# EAGLE design tama (EAGLE 6.5.0)
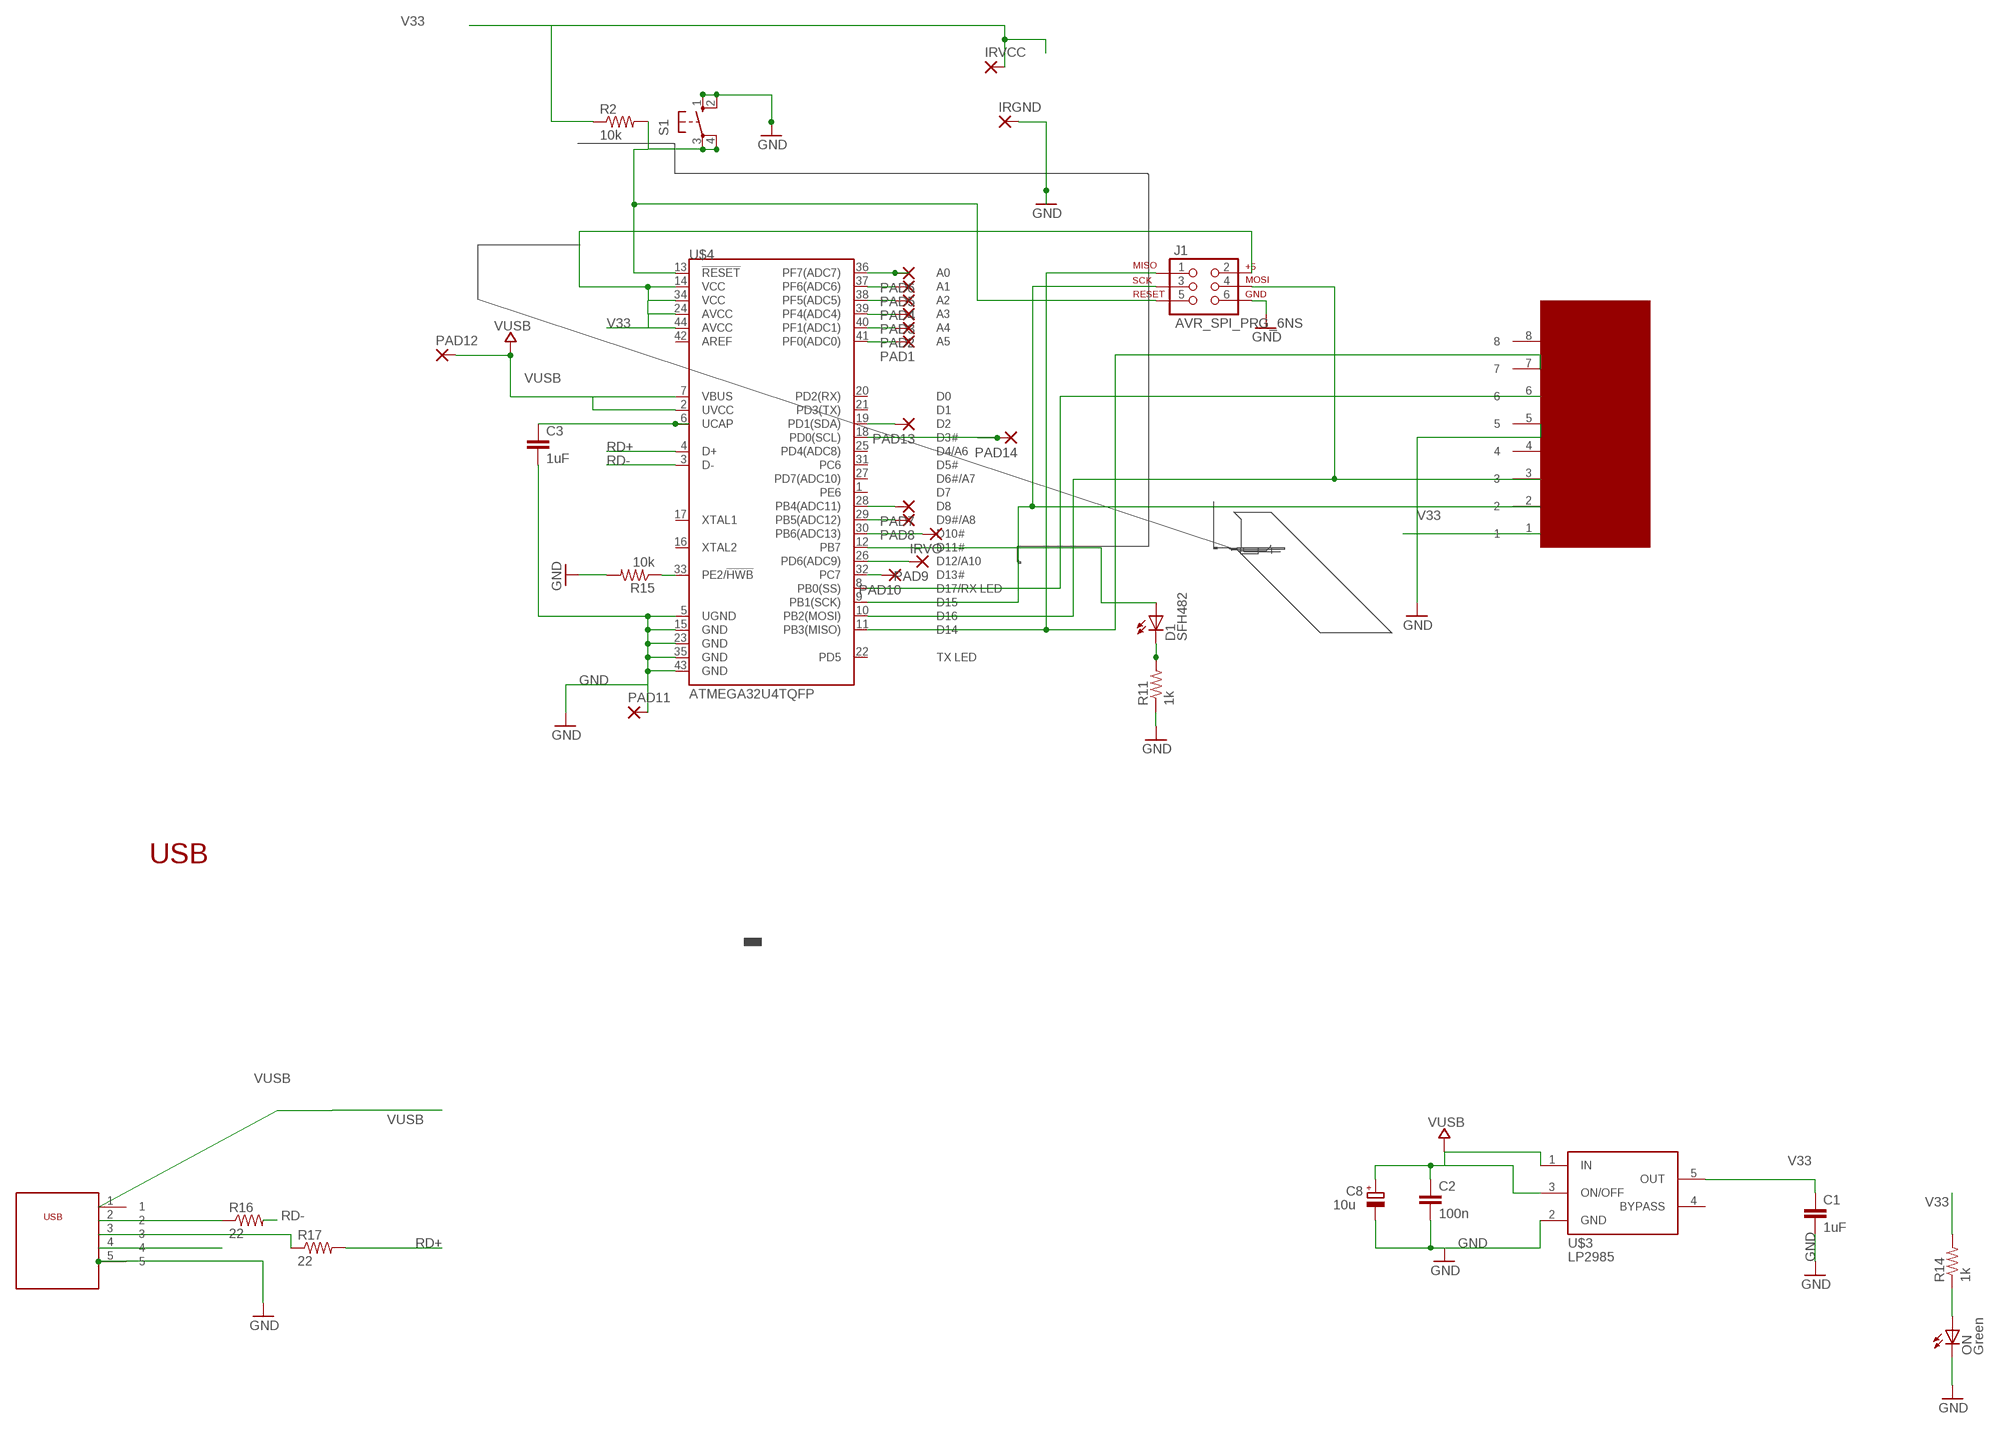
[diagram p0: schematic, sheet 1]

## Parts
C1  1uF  C-EUC1206  [C1206]
C2  100n  C-EUC1206  [C1206]
C3  1uF  C-EUC1206  [C1206]
C8  10u  CPOL-EUSMCB  [SMC_B]
D1  SFH482  [SFH482]
IRGND  2,15/1,0  [2,15/1,0]
IRVCC  2,15/1,0  [2,15/1,0]
IRVO  2,15/1,0  [2,15/1,0]
J1  AVR_SPI_PRG_6NS  [2X3-NS]
ON  Green  LEDCHIPLED_0805  [CHIPLED_0805]
PAD1  2,54/0,8  [2,54/0,8]
PAD2  2,54/0,8  [2,54/0,8]
PAD3  2,54/0,8  [2,54/0,8]
PAD4  2,54/0,8  [2,54/0,8]
PAD5  2,54/0,8  [2,54/0,8]
PAD6  2,54/0,8  [2,54/0,8]
PAD7  2,54/0,8  [2,54/0,8]
PAD8  2,54/0,8  [2,54/0,8]
PAD9  2,54/0,8  [2,54/0,8]
PAD10  2,54/0,8  [2,54/0,8]
PAD11  2,54/0,8  [2,54/0,8]
PAD12  2,54/0,8  [2,54/0,8]
PAD13  2,54/0,8  [2,54/0,8]
PAD14  2,54/0,8  [2,54/0,8]
R2  10k  R-US_R1206W  [R1206W]
R11  1k  R-US_R1206  [R1206]
R14  1k  R-US_R1206  [R1206]
R15  10k  R-US_R1206  [R1206]
R16  22  R-US_R1206  [R1206]
R17  22  R-US_R1206  [R1206]
S1  10-XX  [B3F-10XX]
U$1  TAMA  [TAMACONTACT]
U$2  USB  [USB]
U$3  LP2985  [SOT23-5]
U$4  ATMEGA32U4TQFP  [SPARKFUN-DIGITALIC_TQFP44]

## Nets
D-: R16.1 U$2.2
GND [gnd]: C1.2 C2.2 C3.2 C8.- IRGND.1(P) J1.6 ON.C PAD11.1(P) R11.1 R15.2 S1.1(S) S1.2(S1) U$1.5 U$2.5 U$3.2(GND) U$4.5(UGND) U$4.15(GND) U$4.23(GND) U$4.35(GND) U$4.43(GND)
IO11*: D1.A U$4.12(PB7)
N$1: PAD6.1(P) U$4.36(PF7(ADC7))
N$2: PAD5.1(P) U$4.37(PF6(ADC6))
N$3: ON.A R14.1
N$4: PAD4.1(P) U$4.38(PF5(ADC5))
N$5: PAD3.1(P) U$4.39(PF4(ADC4))
N$6: PAD13.1(P) U$4.19(PD1(SDA))
N$7: D1.K(C) R11.2
N$8: R17.1 U$2.3
N$9: PAD2.1(P) U$4.40(PF1(ADC1))
N$10 [usbvcc]: J1.5 R2.2 S1.3(P) S1.4(P1) U$4.13(!RESET)
N$12: PAD1.1(P) U$4.41(PF0(ADC0))
N$13: PAD14.1(P) U$4.18(PD0(SCL))
N$14: PAD9.1(P) U$4.26(PD6(ADC9))
N$15: R15.1 U$4.33(PE2/!HWB)
N$16: PAD10.1(P) U$4.32(PC7)
N$17: PAD7.1(P) U$4.28(PB4(ADC11))
N$18: PAD8.1(P) U$4.29(PB5(ADC12))
N$19: J1.1 U$1.7 U$4.11(PB3(MISO))
N$20: C3.1 U$4.6(UCAP)
N$22: J1.4 U$1.3 U$4.10(PB2(MOSI))
N$23: U$1.6 U$4.8(PB0(SS))
N$24: IRVO.1(P) U$4.30(PB6(ADC13))
RD+: R17.2 U$4.4(D+)
RD-: R16.2 U$4.3(D-)
SCK: J1.3 U$1.2 U$4.9(PB1(SCK))
USBID: U$2.4
V33: C1.1 IRVCC.1(P) J1.2 R2.1 R14.2 U$1.1 U$3.5(OUT) U$4.14(VCC) U$4.24(AVCC) U$4.34(VCC) U$4.44(AVCC)
VUSB: C2.1 C8.+ PAD12.1(P) U$2.1 U$3.1(IN) U$3.3(ON/OFF) U$4.2(UVCC) U$4.7(VBUS)
Unconnected: U$1.4 U$1.8 U$3.4(BYPASS) U$4.1(PE6) U$4.16(XTAL2) U$4.17(XTAL1) U$4.20(PD2(RX)) U$4.21(PD3(TX)) U$4.22(PD5) U$4.25(PD4(ADC8)) U$4.27(PD7(ADC10)) U$4.31(PC6) U$4.42(AREF)

## Notes on the sheet
- USB
- C:/Users/Natalie/Documents/egg.bmp

## Library data of the parts
C1-C3 = rcl:C-EU: CAPACITOR, European symbol
C8 = rcl:CPOL-EU: POLARIZED CAPACITOR, European symbol
D1 = led:SFH482: IR LED infrared emitting diode, Infineon
IRGND IRVCC IRVO = wirepad:2,15/1,0: THROUGH-HOLE PAD
J1 = SparkFun-Connectors:AVR_SPI_PRG_6: AVR ISP 6 Pin This is the reduced ISP connector for AVR programming. Common on Arduino. This footprint will take up less PCB space and can be used with a 10-pin to 6-pin adapter such as SKU: BOB-08508
ON = led:LED: LED OSRAM: - CHIPLED LG R971, LG N971, LY N971, LG Q971, LY Q971, LO R971, LY R971 LH N974, LH R974 LS Q976, LO Q976, LY Q976 LO Q996 - Hyper CHIPLED LW Q18S LB Q993, LB Q99A, LB R99A - SideLED LS A670, LO A670, LY A670, LG A670, LP A670 LB A673, LV A673, LT A673, LW A673 LH A674 LY A675 LS A676, LA A676, LO A676, LY A676, LW A676 LS A679, LY A679, LG A679 - Hyper Micro SIDELED® LS Y876, LA Y876, LO Y876, LY Y876 LT Y87S - SmartLED LW L88C, LW L88S LB L89C, LB L89S, LG L890 LS L89K, LO L89K, LY L89K LS L896, LA L896, LO L896, LY L896 - TOPLED LS T670, LO T670, LY T670, LG T670, LP T670 LSG T670, LSP T670, LSY T670, LOP T670, LYG T670 LG T671, LOG T671, LSG T671 LB T673, LV T673, LT T673, LW T673 LH T674 LS T676, LA T676, LO T676, LY T676, LB T676, LH T676, LSB T676, LW T676 LB T67C, LV T67C, LT T67C, LS T67K, LO T67K, LY T67K, LW E67C LS E67B, LA E67B, LO E67B, LY E67B, LB E67C, LV E67C, LT E67C LW T67C LS T679, LY T679, LG T679 LS T770, LO T770, LY T770, LG T770, LP T770 LB T773, LV T773, LT T773, LW T773 LH T774 LS E675, LA E675, LY E675, LS T675 LS T776, LA T776, LO T776, LY T776, LB T776 LHGB T686 LT T68C, LB T68C - Hyper Mini TOPLED® LB M676 - Mini TOPLED Santana® LG M470 LS M47K, LO M47K, LY M47K Source: http://www.osram.convergy.de LUXEON: - LUMILED® LXK2-PW12-R00, LXK2-PW12-S00, LXK2-PW14-U00, LXK2-PW14-V00 LXK2-PM12-R00, LXK2-PM12-S00, LXK2-PM14-U00 LXK2-PE12-Q00, LXK2-PE12-R00, LXK2-PE12-S00, LXK2-PE14-T00, LXK2-PE14-U00 LXK2-PB12-K00, LXK2-PB12-L00, LXK2-PB12-M00, LXK2-PB14-N00, LXK2-PB14-P00, LXK2-PB14-Q00 LXK2-PR12-L00, LXK2-PR12-M00, LXK2-PR14-Q00, LXK2-PR14-R00 LXK2-PD12-Q00, LXK2-PD12-R00, LXK2-PD12-S00 LXK2-PH12-R00, LXK2-PH12-S00 LXK2-PL12-P00, LXK2-PL12-Q00, LXK2-PL12-R00 Source: www.luxeon.com KINGBRIGHT: KA-3528ASYC Source: www.kingbright.com
PAD1-PAD14 = wirepad:2,54/0,8: THROUGH-HOLE PAD
R2 R11 R14-R17 = resistor:R-US_: RESISTOR, American symbol
S1 = switch-omron:10-XX: OMRON SWITCH; MPN: B3F-1000; OC_FARNELL: 176432; OC_NEWARK: 36M3542
U$1 = tama:TAMA
U$2 = usb:USB
U$3 = kris-verified:LP2985
U$4 = SparkFun-DigitalIC:ATMEGA32U4: Atmel 44-pin 8-bit Microcontroller with 32KBytes of ISP Flash and USB Controller ----- Please use the QFN-44-NOPAD_1:1 package for the footprint of all boards using a 32U4. Route traces directly away from the pads as much as possible.

## Net classes
0 default: width 0.254 mm, drill 0.61 mm, clearance 0.254 mm
1 power: width 0.254 mm, drill 0.61 mm, clearance 0.254 mm
2 gnd: width 0.254 mm, drill 0.61 mm, clearance 0.254 mm
3 usbvcc: width 0.254 mm, drill 0.61 mm, clearance 0.254 mm
4 aref: width 0.254 mm, drill 0.61 mm, clearance 0.254 mm

## Board
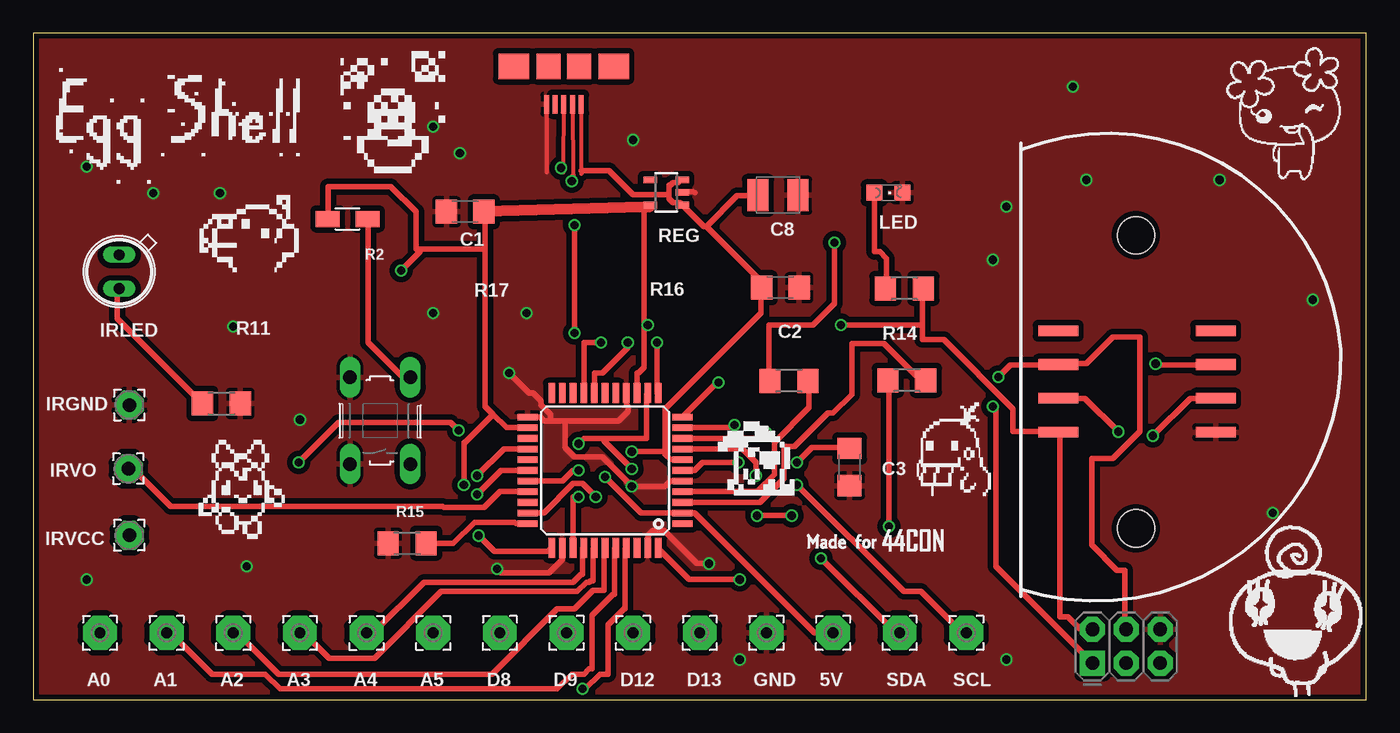
[diagram p1: board, top side]
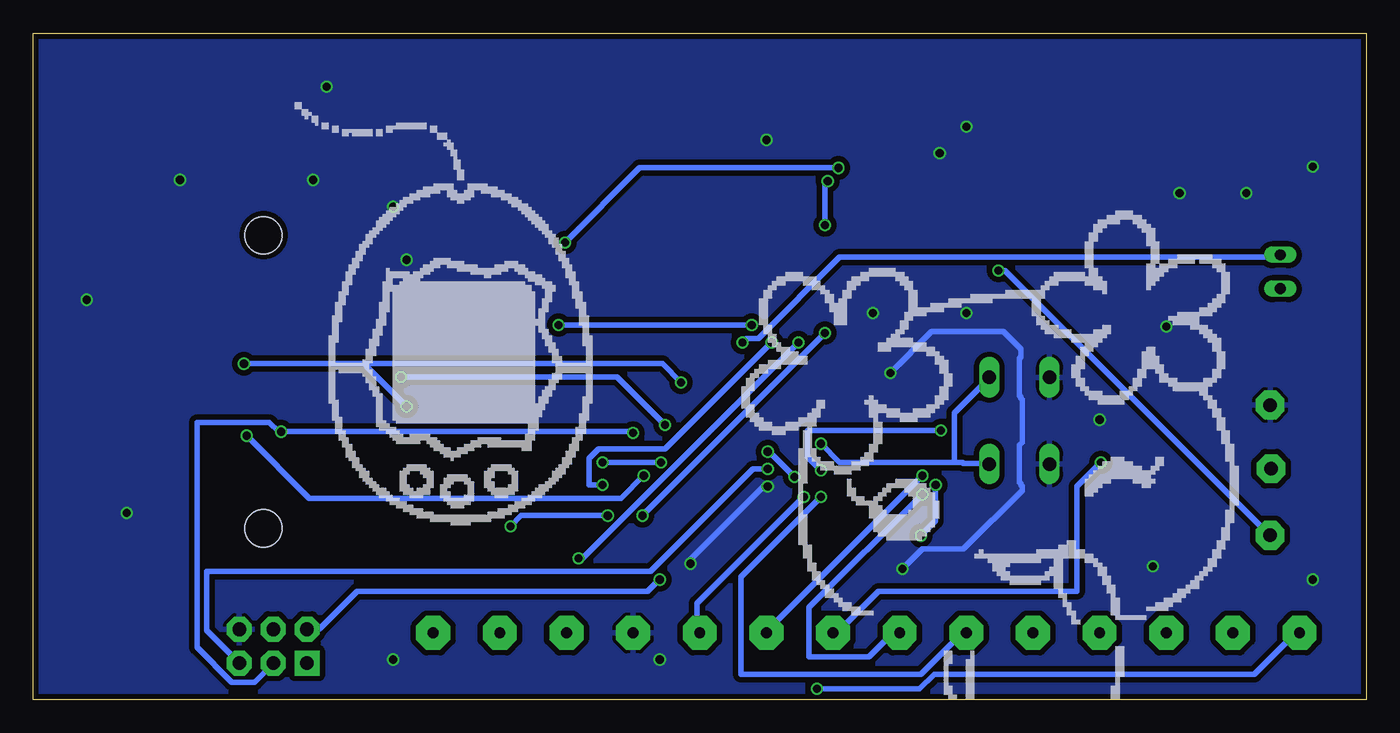
[diagram p2: board, bottom side, seen from below]

Size 100 x 50 mm. Coordinates in mm from the lower left corner, seen from the top.
Outline: 0,0 100,0 100,50 0,50 0,0
Copper layers (1*2*15*16): Top 0.035mm / dielectric 0.2mm / layer 2 0.0175mm / dielectric 1.1mm / layer 15 0.0175mm / dielectric 0.2mm / Bottom 0.035mm
Design rules "SeeedStudio_DRU_no_angle_20130527": minimum track width 6mil, minimum drill 12mil, track to track 6mil, track to pad 6mil, pad to pad 6mil, via to via 6mil, smd to smd 0mil, copper to edge 10mil, drill to drill 10mil, minimum pad ring 6mil, minimum via ring 6mil, stop-mask expansion 2mil, vias tented up to drill 25mil, thermal gap 10mil
Holes 2.8 mm at 82.73,34.84 82.73,12.85

### Footprints (pad centres in the part's own frame; a part is rotated, then mirrored left to right if it is on the bottom)
C1206 = smd 1.6 x 1.8: 1 -1.4,0; 2 1.4,0
SMC_B = smd 1.6 x 2.4: + -1.5,0; - 1.5,0
SFH482 = drill 0.813 long: A -1.27,0; K 1.27,0
2,15/1,0 = drill 1.016 pad 2.159 octagon: 1 0,0
2X3-NS = drill 1.016 pad 1.88 square: 1 -2.54,-1.27 | drill 1.016 pad 1.88 octagon: 2 -2.54,1.27; 3 0,-1.27; 4 0,1.27; 5 2.54,-1.27; 6 2.54,1.27
CHIPLED_0805 = smd 1.2 x 1.2: A 0,-1.05; C 0,1.05
2,54/0,8 = drill 0.813 pad 2.54 octagon: 1 0,0
R1206W = smd 1.8 x 1.2: 1 -1.499,0; 2 1.499,0
R1206 = smd 1.6 x 1.803: 1 -1.422,0; 2 1.422,0
B3F-10XX = drill 1.016 long: 1 -3.251,2.261; 2 3.251,2.261; 3 -3.251,-2.261; 4 3.251,-2.261
TAMACONTACT = smd 3 x 0.8: 1 0,1.81; 2 0,4.35; 3 0,6.89; 4 0,9.43; 5 11.8,1.81; 6 11.8,4.35; 7 11.8,6.89; 8 11.8,9.43
USB = smd 0.38 x 1.4: 1 -1.3,2.85; 2 -0.65,2.85; 3 0,2.85; 4 0.65,2.85; 5 1.3,2.85 | smd 1.8 x 1.9: P$1 -1.15,0; P$2 1.15,0 | smd 2.3 x 1.9: P$3 -3.75,0; P$5 3.75,0
SOT23-5 = smd 0.5 x 1: 1 -0.95,-1.2; 2 0,-1.2; 3 0.95,-1.2; 4 0.95,1.2; 5 -0.95,1.2
SPARKFUN-DIGITALIC_TQFP44 = smd 1.5 x 0.5: 1 -5.8,4; 2 -5.8,3.2; 3 -5.8,2.4; 4 -5.8,1.6; 5 -5.8,0.8; 6 -5.8,0; 7 -5.8,-0.8; 8 -5.8,-1.6; 9 -5.8,-2.4; 10 -5.8,-3.2; 11 -5.8,-4; 23 5.8,-4; 24 5.8,-3.2; 25 5.8,-2.4; 26 5.8,-1.6; 27 5.8,-0.8; 28 5.8,0; 29 5.8,0.8; 30 5.8,1.6; 31 5.8,2.4; 32 5.8,3.2; 33 5.8,4 | smd 0.5 x 1.5: 12 -4,-5.8; 13 -3.2,-5.8; 14 -2.4,-5.8; 15 -1.6,-5.8; 16 -0.8,-5.8; 17 0,-5.8; 18 0.8,-5.8; 19 1.6,-5.8; 20 2.4,-5.8; 21 3.2,-5.8; 22 4,-5.8; 34 4,5.8; 35 3.2,5.8; 36 2.4,5.8; 37 1.6,5.8; 38 0.8,5.8; 39 0,5.8; 40 -0.8,5.8; 41 -1.6,5.8; 42 -2.4,5.8; 43 -3.2,5.8; 44 -4,5.8

### Placement (x,y rotation side)
C1  32.4,36.61 180 top
C2  56.06,30.92 0 top
C3  61.23,17.45 270 top
C8  55.87,37.85 0 top
D1  6.44,32.11 270 top
IRGND  7.21,22.1 0 top
IRVCC  7.21,12.33 0 top
IRVO  7.13,17.33 0 top
J1  82,4 0 top
ON  64.15,38.04 270 top
PAD1  5,5 0 top
PAD2  10,5 0 top
PAD3  15,5 90 top
PAD4  20,5 90 top
PAD5  25,5 90 top
PAD6  30,5 90 top
PAD7  35,5 0 top
PAD8  40,5 0 top
PAD9  45,5 0 top
PAD10  50,5 0 top
PAD11  55,5 0 top
PAD12  60,5 0 top
PAD13  65,5 0 top
PAD14  70,5 0 top
R2  23.58,36.07 0 top
R11  14.11,22.22 180 top
R14  65.35,30.85 0 top
R15  28.04,11.73 180 top
R16  65.54,23.96 0 top
R17  56.7,23.92 0 top
S1  26.01,20.93 90 top
U$1  76.9,18.25 0 top
U$2  39.79,47.52 180 top
U$3  47.48,38.06 90 top
U$4  42.89,17.19 180 top

### Tracks (layer width: path | path; a pad name or v marks a point on that pad's centre or on a via)
D-  (via drill 0.61)
  Top 0.305: U$2.2 40.49,39.3
  Top 0.406: v64.2,13 64.2,23.9 R16.1 | v54.3,13.8 v56.9,13.8 | v40.6,35.6 v40.6,27.5 | v40.4,38.9 40.4,39.2 40.49,39.3
  Bottom 0.406: v64.2,13 63.4,13.8 v56.9,13.8 | v40.6,27.5 v54.3,13.8 | v40.6,35.6 40.6,38.9 v40.4,38.9
GND  (via drill 0.61, 0.61 pad 0.61)
  Top 0.305: U$2.5 38.51,39.56
  Top 0.406: v50.7,10.2 49.8,10.2 47.3,12.7 46.5,12.7 46.1,12.3 U$4.43 | U$4.5 48.6,16.4 47.8,16.4 47.4,16 v44.9,16 44.9,16.2 44.8,16.3 44.6,16.3 42.7,18.2 40.6,18.2 39.9,18.9 39.9,20.9 | 39.9,20.9 43.9,20.9 44.6,21.6 44.6,22 44.5,22.1 44.5,22.9 U$4.15 | 39.9,20.9 38.8,20.9 | 38.8,20.9 38.3,20.9 38,21.2 U$4.23 | v34.8,9.8 35.1,9.5 38.7,9.5 39.7,10.5 39.7,11.3 U$4.35 | v35.7,24.5 37.2,23 37.5,23 38.1,22.4 38.1,22.1 38.8,21.4 38.8,20.9 | U$3.2 48.7,38.1 49.5,38.1 49.64,38.05
  Bottom 0.406: v50.7,10.2 50.7,10.5 45.2,16 v44.9,16 | v34.8,9.8 33.3,11.3 30.2,11.3 25.8,15.7 25.8,16 25.9,16.1 25.9,16.2 26,16.3 26,19.1 25.8,19.3 25.8,22.5 25.9,22.6 25.9,22.7 26,22.8 26,25.6 25.9,25.7 25.9,26.3 27.2,27.6 32.6,27.6 v35.7,24.5
  other vias: 4,40 9,38 14,38 15,28 4,9 16,10 20,21 30,29 32,41 30,43 37,29 45,42 78,46 72,33 73,37 53,3 73,3 93,14 96,30 89,39 79,39
  pour Top (isolate 0.406): 0,0 0,50 100,50 100,0
  pour Bottom (isolate 0.406): 0,0 0,50 2,50 100,50 100,0 99,0
IO11*  (via drill 0.61)
  Top 0.406: v46.8,26.8 46.8,23 U$4.12
  Bottom 0.406: v46.8,26.8 46.5,27.1 45.6,27.1 39.5,33.2 6.6,33.2 6.5,33.3 D1.A
N$1  (via drill 0.61)
  Top 0.406: v40.9,15.2 40.5,15.2 U$4.36
  Bottom 0.406: v40.9,15.2 46.9,9.2 46.9,1.9 33.4,1.9 30.4,4.9 30,4.9 PAD6.1
N$2
  Top 0.406: PAD5.1 25.5,5 29.3,8.8 40.5,8.8 41.1,9.4 41.2,9.4 41.2,11.3 U$4.37 | PAD5.1
N$3
  Top 0.406: ON.A 63.1,38 63.1,33.6 63.5,33.6 64,33.1 64,30.9 R14.1
N$4
  Top 0.406: U$4.38 42,11.3 42,8.9 41.8,8.9 41.7,8.8 41.5,8.8 40.8,8.1 30.6,8.1 25.6,3.1 22.2,3.1 20.4,4.9 20,4.9 PAD4.1
N$5
  Top 0.406: U$4.39 42.8,11.3 42.8,8.2 42,8.2 40.6,6.8 39.3,6.8 34.4,1.9 18.4,1.9 15.4,4.9 15,4.9 PAD3.1
N$6  (via drill 0.61)
  Top 0.406: v42.6,26.8 41.3,26.8 U$4.19 | v59.1,10.6 64.7,5 64.9,5 PAD13.1
  Bottom 0.406: v42.6,26.8 58.8,10.6 v59.1,10.6
N$7
  Top 0.406: R11.2 12.6,22.3 6.3,28.6 6.3,30.8 6.4,30.8 D1.K
N$8  (via drill 0.61)
  Top 0.305: U$2.3 39.76,39.9 39.75,39.56
  Top 0.406: v60.1,34.3 60.1,29.7 58.5,28.1 55.2,28.1 55.2,24 R17.1 | v39.6,39.9 39.7,39.9 39.76,39.9
  Bottom 0.406: v60.1,34.3 54.5,39.9 v39.6,39.9
N$9
  Top 0.406: U$4.40 43.6,11.3 43.6,7.9 43.5,7.9 41.9,6.3 41.9,2.3 41.7,2.3 41.3,1.9 40.4,1.9 39.3,0.8 18.5,0.8 17.4,1.9 13.4,1.9 10.4,4.9 10,4.9 PAD2.1
N$10  (via drill 0.61)
  Top 0.406: R2.2 25.1,36 25.1,26.8 27.7,24.2 28.2,24.2 S1.4 | 42.8,19.6 41.3,19.6 v40.9,19.2 | 42.8,19.6 46,19.6 46,22.9 U$4.13 | v44.9,17.3 42.8,19.4 42.8,19.6
  Bottom 0.406: v40.9,19.2 39.5,17.8 30.9,17.8 | 30.9,17.8 30.3,17.8 30.2,17.7 28.3,17.7 S1.3 | v44.9,17.3 46,17.3 53.7,9.6 87,9.6 87,5.2 84.6,2.8 J1.5 | 30.9,17.8 30.9,21.5 28.3,24.1 S1.4
N$12  (via drill 0.61)
  Top 0.406: v41.2,0.8 41.4,0.8 42.5,1.9 43.1,1.9 43.1,5.6 44.3,6.8 44.4,6.8 44.4,11.3 U$4.41
  Bottom 0.406: v41.2,0.8 33.5,0.8 32.4,1.9 8.4,1.9 5.4,4.9 5,4.9 PAD1.1
N$13  (via drill 0.61)
  Top 0.406: v44.6,26.8 44.6,26.4 42.7,24.5 42.1,24.5 U$4.18 | v57.3,16.1 65.3,8.1 66.6,8.1 69.7,5 69.9,5 PAD14.1
  Bottom 0.406: v44.6,26.8 52.6,18.8 57.6,18.8 58.3,18.1 58.3,16.1 v57.3,16.1
N$14  (via drill 0.61)
  Top 0.406: v33.3,16.8 35.3,18.8 37,18.8 U$4.26
  Bottom 0.406: v33.3,16.8 44.9,5.2 44.9,5 PAD9.1
N$15
  Top 0.406: U$4.33 37,13.2 36.2,13.2 36.1,13.3 33.1,13.3 31.5,11.7 29.5,11.7 R15.1
N$16  (via drill 0.61)
  Top 0.406: v42.2,15.2 41.2,16.2 40.5,16.2 38.3,14 U$4.32
  Bottom 0.406: v42.2,15.2 50.2,7.2 50.2,5 PAD10.1 | PAD10.1
N$17  (via drill 0.61)
  Top 0.406: v33.3,15.4 35.1,17.2 37,17.2 U$4.28
  Bottom 0.406: v33.3,15.4 41.8,6.9 41.8,3.2 37.3,3.2 35.6,4.9 35,4.9 PAD7.1
N$18  (via drill 0.61)
  Top 0.406: v40.9,17.2 40.5,17.2 39.7,16.4 U$4.29 | v31.9,20.2 31.3,20.8 22.9,20.8 v19.9,17.8
  Bottom 0.406: v40.9,17.2 41.9,18.2 41.9,20.2 v31.9,20.2 | v19.9,17.8 21.7,16 21.7,8.1 36.6,8.1 39.7,5 39.9,5 PAD8.1
N$19  (via drill 0.61)
  Top 0.406: v51.4,23.8 51.3,23.8 U$4.11 | v84.2,25.2 84.3,25.1 88.7,25.1 U$1.7 | v72,22 72.2,22 72.2,10 79.4,2.8 J1.1
  Bottom 0.406: v51.4,23.8 52.8,25.2 75,25.2 | v84.2,25.2 75,25.2 | v72,22 75,25 75,25.2
N$20  (via drill 0.61)
  Top 0.406: v52.9,17.8 50.2,17.8 49.6,17.2 U$4.6 | v57.3,17.8 58.4,18.9 61.2,18.9 C3.1
  Bottom 0.406: v57.3,17.8 v52.9,17.8
N$22  (via drill 0.61)
  Top 0.406: v52.6,20.6 52.4,20.4 U$4.10 | v72.4,24.2 73.3,25.1 76.9,25.1 U$1.3 77.1,25.2 79,25.2 81,27.2 83,27.2 83,20.1 81,18.1 79.4,18.1 79.4,11.6 81.3,9.7 81.9,9.7 81.9,5.3 J1.4
  Bottom 0.406: v52.6,20.6 56.2,24.2 v72.4,24.2
N$23  (via drill 0.61)
  Top 0.406: v54.2,16.8 54.2,17.8 53.2,18.8 U$4.8 | v84,19.8 86.8,22.6 U$1.6
  Bottom 0.406: v54.2,16.8 55.9,15.1 79.3,15.1 v84,19.8
N$24
  Top 0.406: U$4.30 37,15.6 35,15.6 33.8,14.4 30.8,14.4 30.7,14.5 10.3,14.5 7.5,17.3 7.2,17.3 IRVO.1
RD+
  Top 0.406: U$4.4 54.3,15.6 55.6,16.9 55.6,19.3 58.2,21.9 58.2,23.9 R17.2
RD-
  Top 0.406: U$4.3 54.5,14.8 56.3,16.6 56.3,19 57.1,19 59.6,21.5 60,21.5 61.4,22.9 61.4,26.7 63.8,26.7 66.5,24 66.9,24 R16.2
SCK  (via drill 0.61)
  Top 0.406: v55,20 54.6,19.6 U$4.9 | v81.4,20.1 78.9,22.6 77,22.6 U$1.2
  Bottom 0.406: v55,20 55.1,20.1 v81.4,20.1 81.6,20.1 82.3,20.8 87.7,20.8 87.7,3.9 85.1,1.3 83.4,1.3 82,2.7 J1.3
V33  (via drill 0.61)
  Top 0.406: U$3.5 46.23,36.96 | 66.7,28.1 66.7,27 68.3,27 73.5,21.8 73.5,20.1 76.9,20.1 U$1.1 77,19.9 77,6.2 77.6,6.2 78.5,5.3 79.4,5.3 J1.2 | 66.7,28.1 66.7,30.8 R14.2 | v53,9 49.2,9 46.9,11.3 U$4.44 | 34.5,21.4 33.9,22 33.9,33.8 | 34.5,21.4 35.5,20.4 37,20.4 U$4.24 | 33.9,33.8 33.9,36.3 C1.1 | v33.4,12.3 34.6,11.1 38.6,11.1 38.8,11.3 U$4.34 | v32.3,16.1 32.3,19.3 32.4,19.3 34.5,21.4 | 45.8,28.1 45.8,36.6 45.79,36.95 | 45.8,28.1 45.8,24.9 45.4,24.5 45.3,24.5 U$4.14 | 33.9,33.8 29,33.8 | 29,33.8 28.7,33.8 28.7,36.6 26.8,38.5 22.1,38.5 22.1,36.1 R2.1 | v27.6,32.2 29,33.6 29,33.8 | v60.6,28.1 66.7,28.1 | v46.1,28.1 45.8,28.1
  Top 0.813: 46.23,36.96 45.79,36.95 C1.1
  Bottom 0.406: v53,9 53.9,8.1 75.7,8.1 78.5,5.3 79.4,5.3 J1.2 | v33.4,12.3 32.3,13.4 v32.3,16.1 | v27.6,32.2 27.1,32.2 7.3,12.4 IRVCC.1 | v46.1,28.1 v60.6,28.1
VUSB  (via drill 0.61)
  Top 0.305: U$2.1 41.11,39.7 41.11,39.44
  Top 0.406: PAD12.1 59.9,5 58.6,5 49.6,14 U$4.2 48.5,14 45.6,14 v42.9,16.7 | 47.7,37.9 47.7,38.6 47.8,38.6 48,38.8 48.4,38.8 48.6,39 U$3.3 | 47.7,37.9 47.7,37.6 48,37.3 48.5,37.3 48.6,37.2 U$3.1 48.8,37 50.3,35.5 50.5,35.5 | 50.5,35.5 52.8,37.8 54.3,37.8 C8.+ | 47.7,37.9 45,37.9 43.2,39.7 41.2,39.7 41.11,39.7 | 47.4,18.6 47.4,21.8 54.6,29 54.6,30.9 C2.1 54.6,31.1 54.6,31.4 50.5,35.5 | 47.4,18.6 47.4,18.4 47.8,18 48.6,18 U$4.7 | 47.4,18.6 v44.9,18.6
  Bottom 0.406: v42.9,16.7 44.8,18.6 v44.9,18.6

### Text on the board
tPlace: C8 | LED | C1 | REG | R2 | R17 | R16 | IRLED | R11 | C2 | R14 | IRGND | IRVO | C3 | R15 | IRVCC | A0 | A1 | A2 | A3 | A4 | A5 | D8 | D9 | D12 | D13 | GND | 5V | SDA | SCL
tStop: Natalie Silvanovich / @natashenka / natashenka@kwartzlab.ca